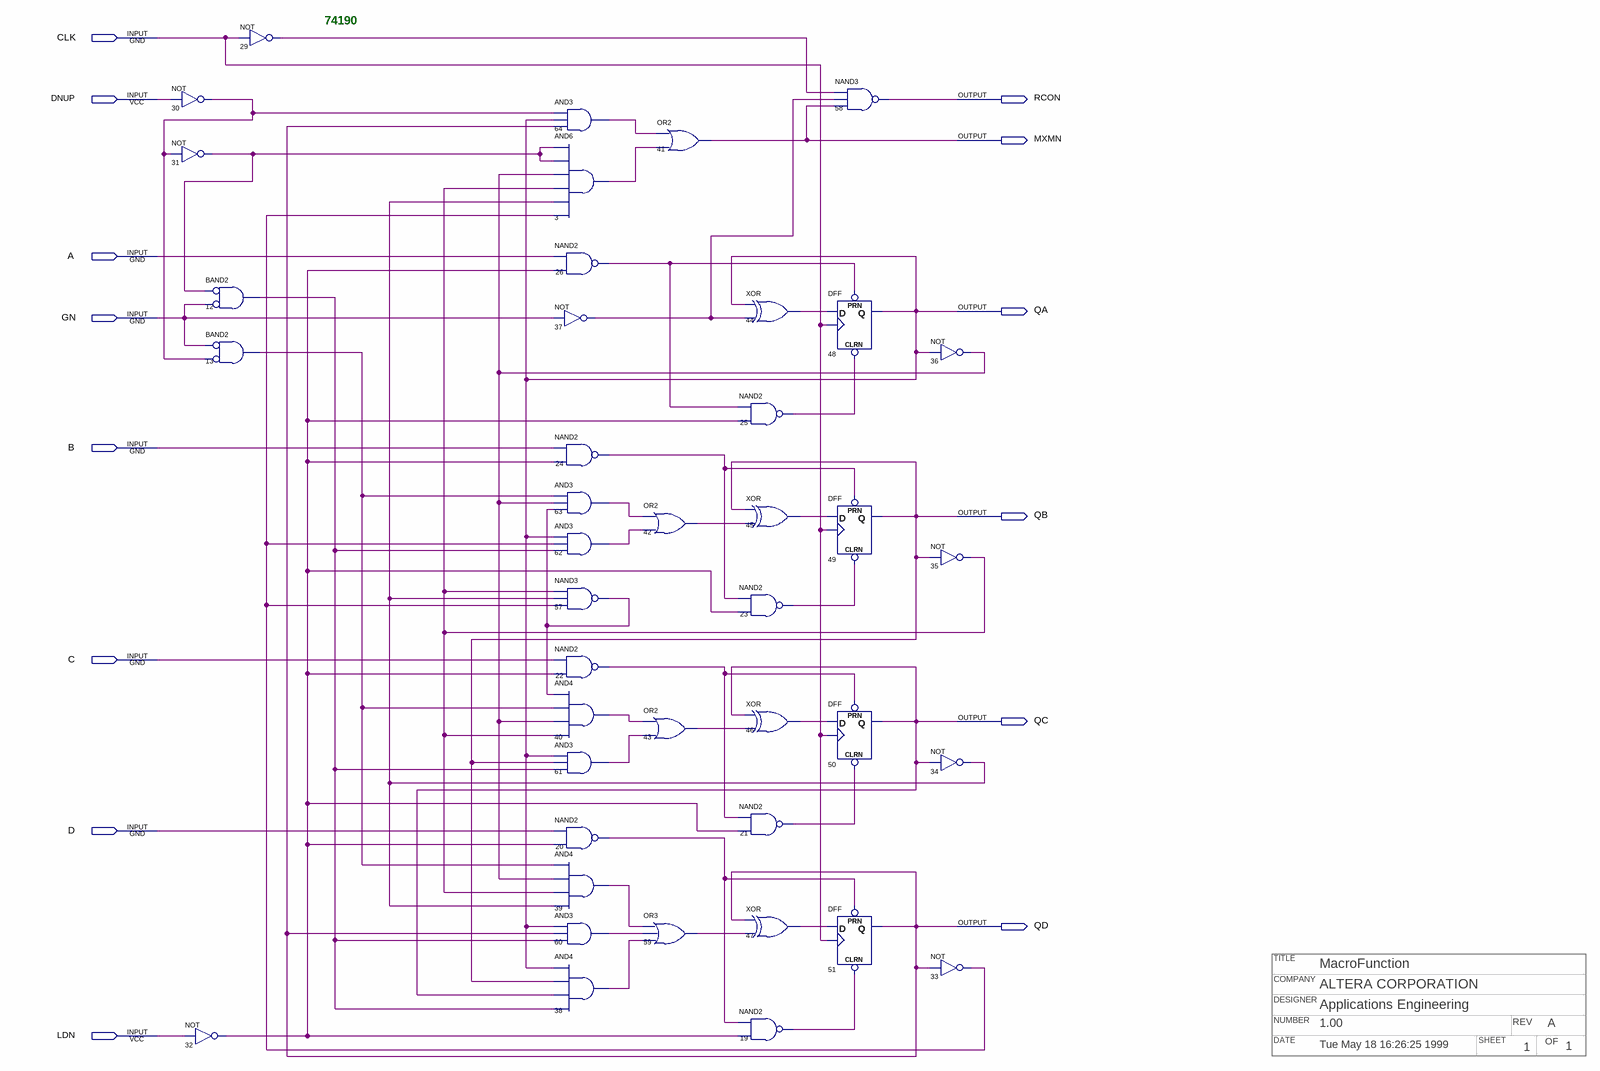
[diagram p0: schematic sheet]
// Quartus schematic 74190.bdf as structural Verilog: 42 symbols, 14 pins
// Title block: TITLE: MacroFunction; COMPANY: ALTERA CORPORATION; DESIGNER: Applications Engineering; NUMBER: 1.00; REV: A; DATE: Tue May 18 16:26:25 1999; SHEET: 1; OF: 1
module \74190  (
  input  CLK,
  input  DNUP,
  input  A,
  input  GN,
  input  B,
  input  C,
  input  D,
  input  LDN,
  output RCON,
  output MXMN,
  output QA,
  output QB,
  output QC,
  output QD
);

  wire n3_out, n12_out, n13_out, n19_out, n20_out, n21_out, n22_out, n23_out, n24_out, n25_out, n26_out,
       n29_out, n30_out, n31_out, n32_out, n33_out, n34_out, n35_out, n36_out, n37_out, n38_out, n39_out,
       n40_out, n42_out, n43_out, n44_out, n45_out, n46_out, n47_out, n57_out, n59_out, n60_out, n61_out,
       n62_out, n63_out, n64_out;

  not u_30 (n30_out, DNUP);
  not u_31 (n31_out, n30_out);
  and u_12 (n12_out, ~n31_out, ~GN);  // BAND2
  and u_13 (n13_out, ~GN, ~n30_out);  // BAND2
  not u_32 (n32_out, LDN);
  not u_29 (n29_out, CLK);
  and u_64 (n64_out, n30_out, QA, QD);
  and u_3 (n3_out, n31_out, n31_out, n36_out, n35_out, n34_out, n33_out);
  nand u_26 (n26_out, A, n32_out);
  not u_37 (n37_out, GN);
  nand u_24 (n24_out, B, n32_out);
  and u_63 (n63_out, n13_out, n36_out, n57_out);
  and u_62 (n62_out, QA, n33_out, n12_out);
  nand u_57 (n57_out, n35_out, n34_out, n33_out);
  nand u_22 (n22_out, C, n32_out);
  and u_40 (n40_out, n57_out, n13_out, n36_out, n35_out);
  and u_61 (n61_out, QA, QB, n12_out);
  nand u_20 (n20_out, D, n32_out);
  and u_39 (n39_out, n13_out, n36_out, n35_out, n34_out);
  and u_60 (n60_out, QA, QD, n12_out);
  and u_38 (n38_out, QA, QB, QC, n12_out);
  or u_41 (MXMN, n64_out, n3_out);
  or u_42 (n42_out, n63_out, n62_out);
  or u_43 (n43_out, n40_out, n61_out);
  or u_59 (n59_out, n39_out, n60_out, n38_out);
  xor u_44 (n44_out, QA, n37_out);
  nand u_25 (n25_out, n26_out, n32_out);
  xor u_45 (n45_out, QB, n42_out);
  nand u_23 (n23_out, n24_out, n32_out);
  xor u_46 (n46_out, QC, n43_out);
  nand u_21 (n21_out, n22_out, n32_out);
  xor u_47 (n47_out, QD, n59_out);
  nand u_19 (n19_out, n20_out, n32_out);
  nand u_58 (RCON, n29_out, n37_out, MXMN);
  DFF u_48 (.CLRN(n25_out), .CLK(CLK), .D(n44_out), .PRN(n26_out), .Q(QA));
  DFF u_49 (.CLRN(n23_out), .CLK(CLK), .D(n45_out), .PRN(n24_out), .Q(QB));
  DFF u_50 (.CLRN(n21_out), .CLK(CLK), .D(n46_out), .PRN(n22_out), .Q(QC));
  DFF u_51 (.CLRN(n19_out), .CLK(CLK), .D(n47_out), .PRN(n20_out), .Q(QD));
  not u_36 (n36_out, QA);
  not u_35 (n35_out, QB);
  not u_34 (n34_out, QC);
  not u_33 (n33_out, QD);

  // Notes on the sheet:
  //   74190
endmodule
